# Altium schematic sheet POWER_BQ25120.SchDoc
size A
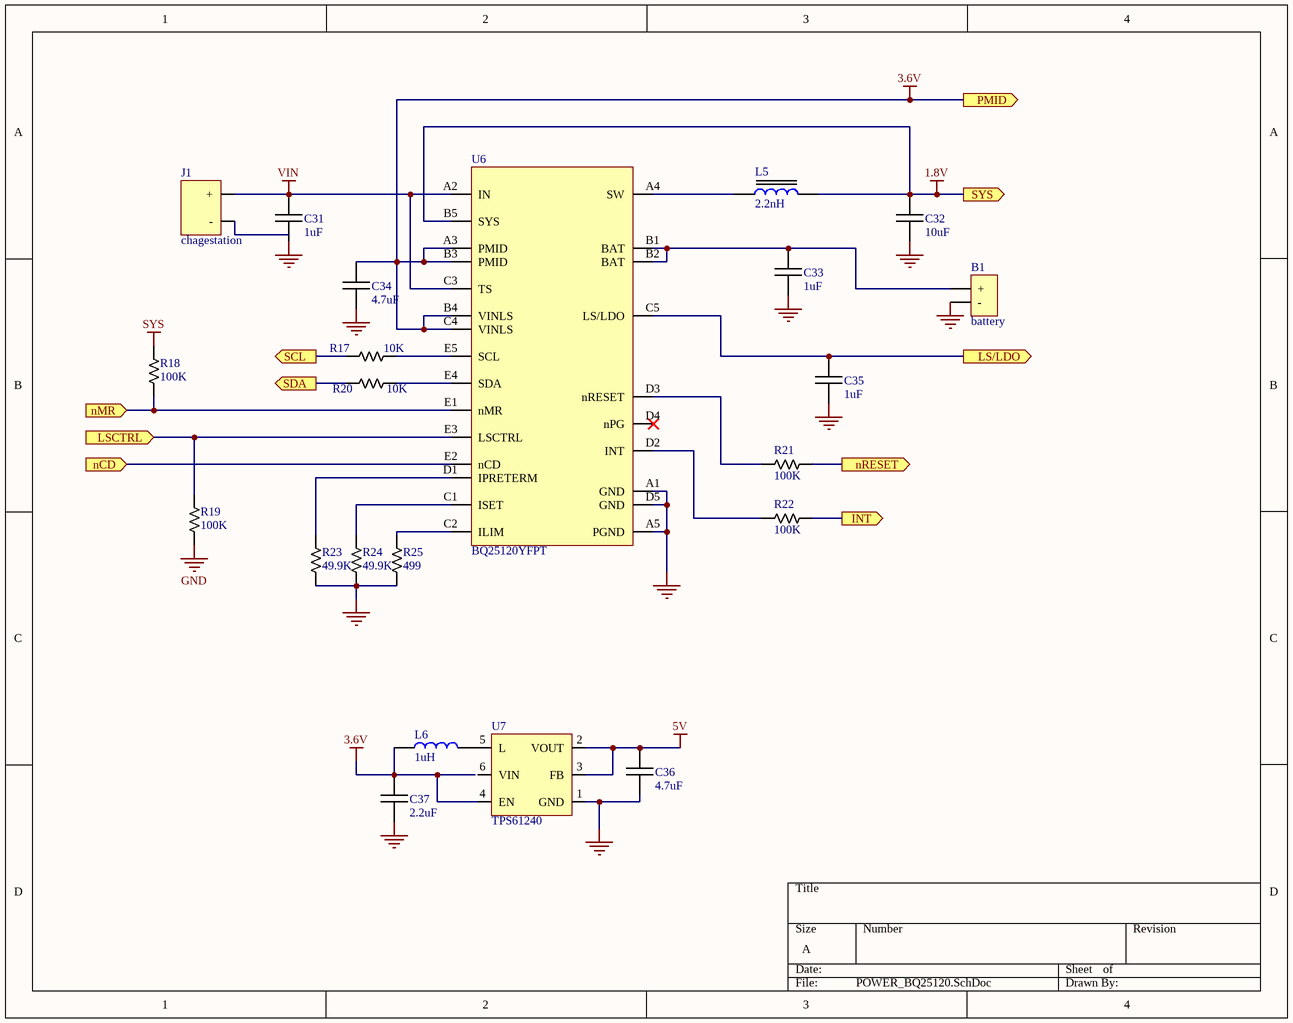
[diagram p0: POWER_BQ25120.SchDoc]

## Parts
B1  battery
C31  1uF
C32  10uF
C33  1uF
C34  4.7uF  [C0603]
C35  1uF
C36  4.7uF
C37  2.2uF
J1  chagestation
L5  2.2nH
L6  1uH
R17  10K  [R0603]
R18  100K  [R0603]
R19  100K  [R0603]
R20  10K  [R0603]
R21  100K  [R0603]
R22  100K  [R0603]
R23  49.9K
R24  49.9K
R25  499
U6  BQ25120YFPT
U7  TPS61240

## Ports
INT (out), LS/LDO (out), LSCTRL (in), nCD (in), nMR (in), nRESET (out), PMID (out), SCL (out), SDA (out), SYS (out)

## Nets
1.8V: C32.2 L5.2 U6.B5(SYS) ; port SYS
3.6V: C34.2 C37.2 L6.1 U6.A3(PMID) U6.B3(PMID) U6.B4(VINLS) U6.C4(VINLS) U7.4(EN) ; port PMID
5V: C36.2 U7.2(VOUT) U7.3(FB)
GND: B1.- C31.1 C32.1 C33.1 C34.1 C35.1 C36.1 C37.1 R19.1 R23.1 R24.1 R25.1 U6.A1(GND) U6.A5(PGND) U6.D5(GND) U7.1(GND)
SYS: R18.2
VIN: C31.2 J1.+ U6.A2(IN) U6.C3(TS)
INT: R22.1 ; port INT
LS/LDO: C35.2 U6.C5(LS/LDO) ; port LS/LDO
LSCTRL: R19.2 U6.E3(LSCTRL) ; port LSCTRL
nCD: U6.E2(nCD) ; port nCD
nMR: R18.1 U6.E1(nMR) ; port nMR
nRESET: R21.1 ; port nRESET
SCL: R17.1 ; port SCL
SDA: R20.1 ; port SDA
NetB1_+: B1.+ C33.2 U6.B1(BAT) U6.B2(BAT)
NetL5_1: L5.1 U6.A4(SW)
NetL6_2: L6.2 U7.5(L)
NetR17_2: R17.2 U6.E5(SCL)
NetR20_2: R20.2 U6.E4(SDA)
NetR21_2: R21.2 U6.D3(nRESET)
NetR22_2: R22.2 U6.D2(INT)
NetR23_2: R23.2 U6.D1(IPRETERM)
NetR24_2: R24.2 U6.C1(ISET)
NetR25_2: R25.2 U6.C2(ILIM)

Not connected (* = marked no-connect by the designer): J1 -; U6 D4(nPG)*; U7 6(VIN)

## Library data of the parts
B1 = Battery: 100MAH; website: https://www.adafruit.com/product/1570
C31 C33 C35 = C1uF_0402: SMD_CAPACITOR; Voltage - Rated: 10V; Tolerance: ±10%; Packet: 0402; Digi-Key Part Number: 490-3890-1-ND; Capacitance: 1uF
C32 = C10uF_0603: SMD_CAPACITOR; Voltage - Rated: 6.3V; Tolerance: ±20%; Packet: 0603; Digi-Key Part Number: 490-3896-1-ND; Capacitance: 10uF
C34 = C4.7u_0603: SMD_CAPACITOR; Voltage - Rated: 16V; Tolerance: ±10%; Packet: 0603; Digi-Key Part Number: 311-1785-1-ND; Capacitance: 4.7uF
C36 = C4.7uF_0402: SMD_CAPACITOR; Voltage - Rated: 6.3V; Tolerance: ±20%; Packet: 0402; Digi-Key Part Number: 587-2787-1-ND; Capacitance: 4.7uF
C37 = C2.2uF_0402: SMD_CAPACITOR; Voltage - Rated: 6.3V; Tolerance: ±20%; Packet: 0402; Digi-Key Part Number: 587-1453-1-ND; Capacitance: 2.2uF
L5 = L2.2nH_0201: SMD_Inductor; Digi-Key Part Number: LQP03TG2N2C02D; Inductance: 2.2nH; Package: 0201
L6 = L1uH_0603: SMD_Inductor; Digi-Key Part Number: 490-15634-1-ND; Inductance: 1uH; Package: 0603
R17 R20 = R10K_0201: SMD_RESISTOR; Packet: 0201; Tolerance: ±5%; Power: 1/20W; Digi-Key Part Number: 311-10KNCT-ND; Value: 10K
R18 R19 R21 R22 = R100K_0402: SMD_RESISTOR; Packet: 0402; Tolerance: ±5%; Power: 1/16W; Digi-Key Part Number: 541-2190-1-ND; Value: 100K
R23 R24 = R49.9K_0402: SMD_RESISTOR; Packet: 0402; Tolerance: ±1%; Power: 1/16W; Digi-Key Part Number: 311-49.9KLRCT-ND; Value: 49.9K
R25 = R499_0402: SMD_RESISTOR; Packet: 0402; Tolerance: ±1%; Power: 1/16W; Digi-Key Part Number: 311-499LRCT-ND; Value: 499
U6 = BQ25120YFF: Digi-Key Part Number: 296-42554-1-ND
U7 = TPS61240: IC REG BOOST 5V 0.5A SYNC 6SON; Digi-Key Part Number: 296-39437-1-ND